# EAGLE schematic schematic (EAGLE 7.2.0)
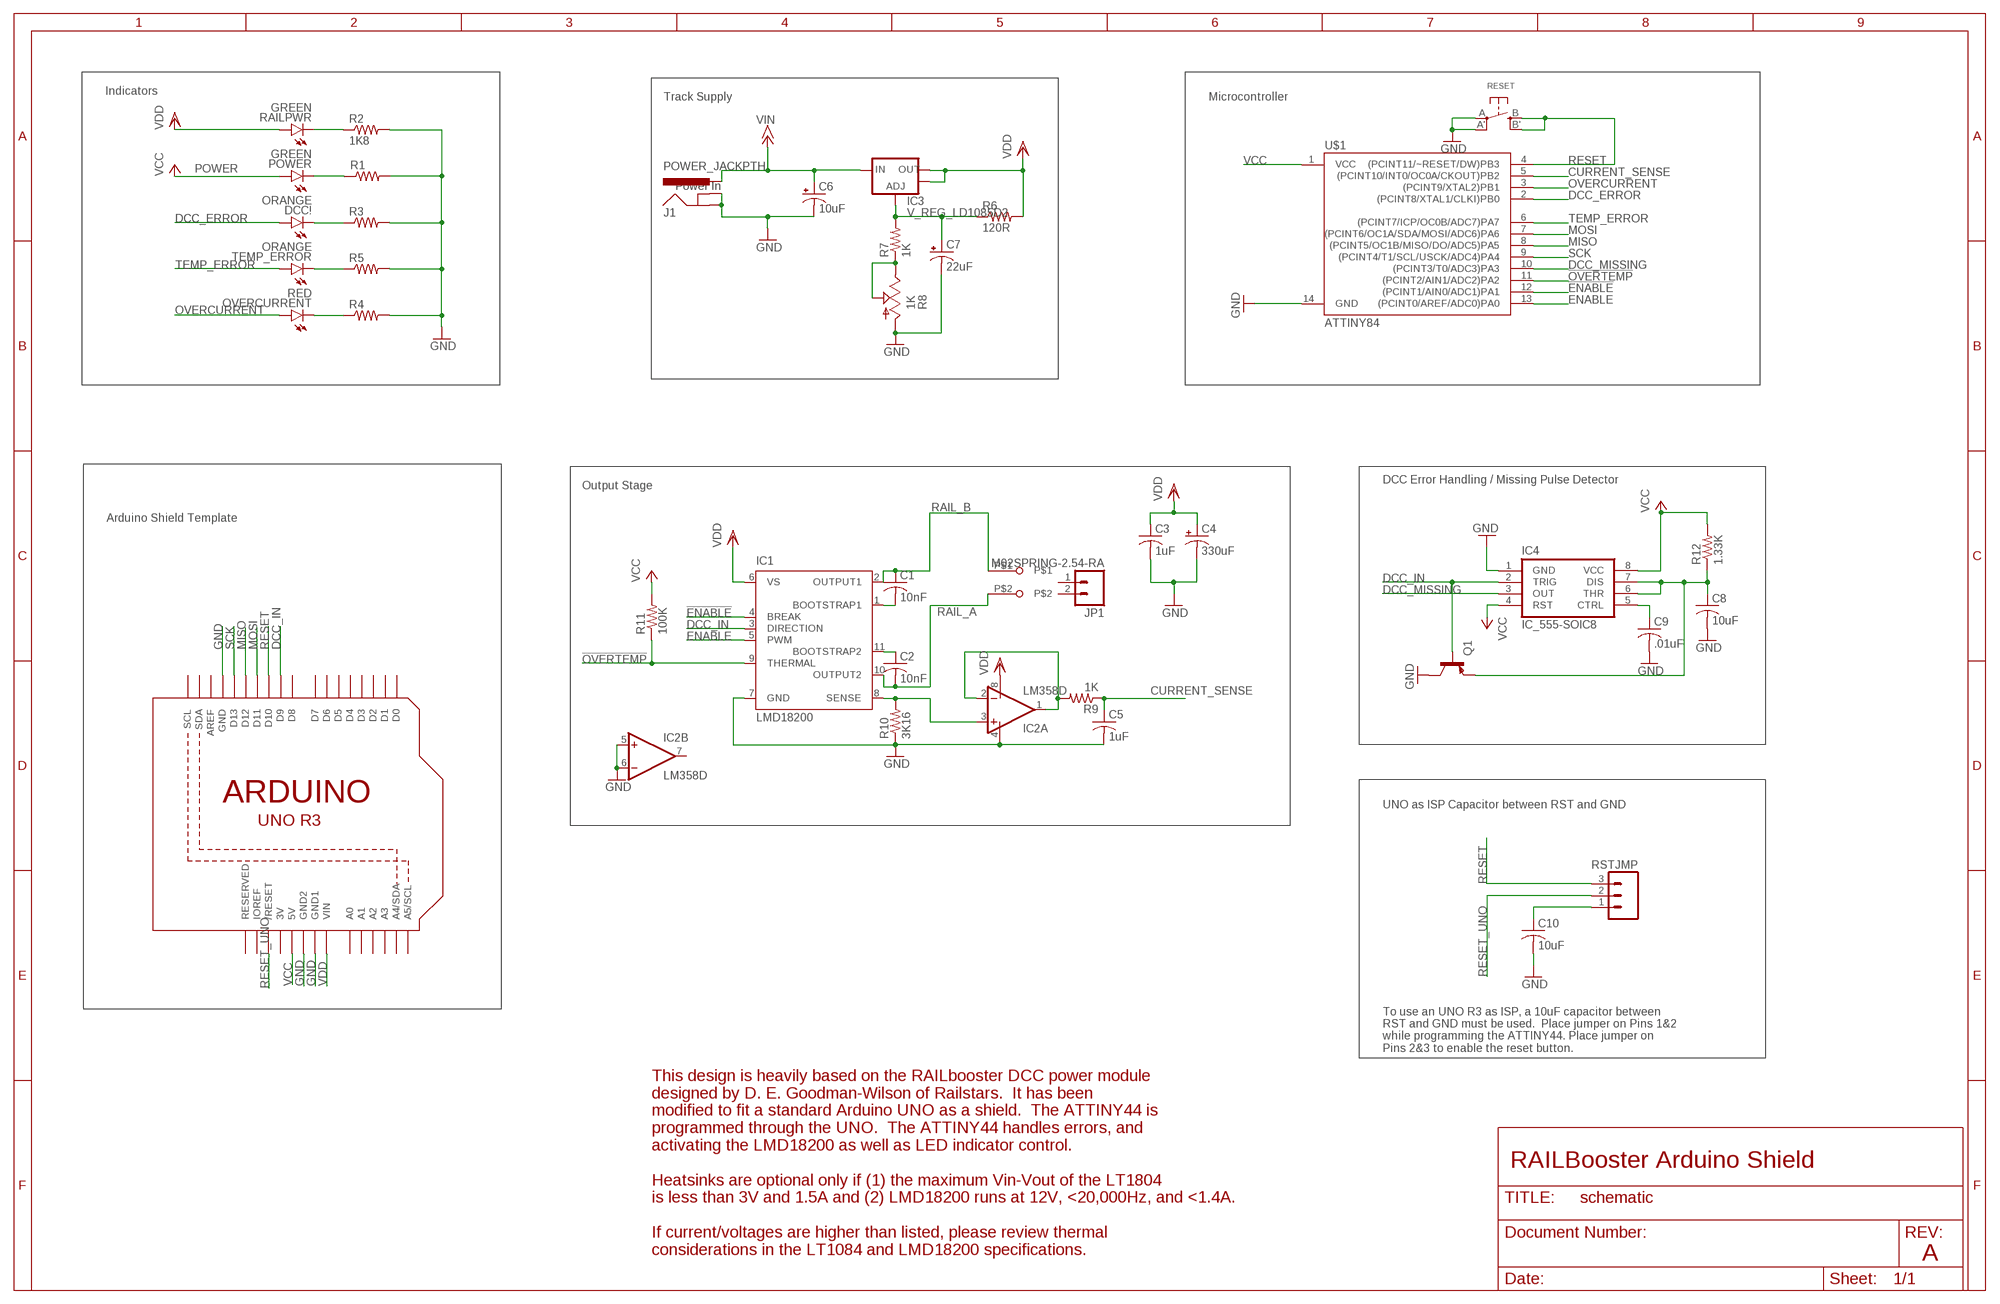
[diagram p0: schematic, sheet 1]

## Parts
C1  10nF  C-USC1206  [C1206]
C2  10nF  C-USC1206  [C1206]
C3  1uF  C-USC1206  [C1206]
C4  330uF  CPOL-USE5-10.5  [E5-10,5]
C5  1uF  C-USC1206  [C1206]
C6  10uF  CPOL-USE2-5  [E2-5]
C7  22uF  CPOL-USE2-5  [E2-5]
C8  10uF  C-USC1206  [C1206]
C9  .01uF  C-USC1206  [C1206]
C10  10uF  C-USC1206  [C1206]
DCC!  ORANGE  LED1206  [LED-1206]
IC1  LMD18200  LM18200T  [TO-220-11]
IC2  LM358D  [SO08]
IC3  V_REG_LD1085D2  [D2PACK/A]
IC4  IC_555-SOIC8  [SOIC-8]
J1  POWER_JACKPTH  [POWER_JACK_PTH]
JP1  M02SPRING-2.54-RA  [SPRINGTERMINAL-2.54MM-2]
OVERCURRENT  RED  LED1206  [LED-1206]
POWER  GREEN  LED1206  [LED-1206]
Q1  TRANSISTOR_BJT_PNP-SOT-23-BCE  [SOT-23]
R1  RESISTOR1206  [1206]
R2  1K8  RESISTOR1206  [1206]
R3  RESISTOR1206  [1206]
R4  RESISTOR1206  [1206]
R5  RESISTOR1206  [1206]
R6  120R  RESISTOR1206  [1206]
R7  1K  RESISTOR1206  [1206]
R8  1K  TRIM_US-S64W  [S64W]
R9  1K  RESISTOR1206  [1206]
R10  3K16  RESISTOR1206  [1206]
R11  100K  RESISTOR1206  [1206]
R12  1.33K  RESISTOR1206  [1206]
RAILPWR  GREEN  LED1206  [LED-1206]
RESET  SWITCH_TACT_SMT  [EVQ-Q2]
RSTJMP  M03PTH  [1X03]
TEMP_ERROR  ORANGE  LED1206  [LED-1206]
U1  ARDUINOR3-DIMENSION  [ARDUINOR3]
U$1  ATTINY84  [SO14]
X4  SCREWTERMINAL-5.08-2  [SCREWTERMINAL-5.08-2]

## Nets
!ENABLE: IC1.4(BREAK) U$1.12((PCINT1/AIN0/ADC1)PA1)
!OVERTEMP: IC1.9(THERMAL) R11.1 U$1.11((PCINT2/AIN1/ADC2)PA2)
CTRL: C9.1 IC4.5(CTRL)
CURRENT_SENSE: C5.1 R9.1 U$1.5((PCINT10/INT0/OC0A/CKOUT)PB2)
CURRENT_SENSE_UNBUFFERED: IC2.1(A:OUT) IC2.2(A:-IN) R9.2
DCC_ERROR: DCC!.A U$1.2((PCINT8/XTAL1/CLKI)PB0)
DCC_IN: IC1.3(DIRECTION) IC4.2(TRIG) Q1.1(B) U1.D9
DCC_MISSING: IC4.3(OUT) U$1.10((PCINT3/T0/ADC3)PA3)
ENABLE: IC1.5(PWM) U$1.13((PCINT0/AREF/ADC0)PA0)
GND: C3.2 C4.- C5.2 C6.- C7.- C8.2 C9.2 C10.2 IC1.7(GND) IC2.4(P:V-) IC2.5(B:+IN) IC2.6(B:-IN) IC4.1(GND) J1.GND J1.GNDBREAK Q1.2(C) R1.2 R2.2 R3.2 R4.2 R5.2 R8.A R10.1 RESET.A'(P1) RESET.A(P) U1.GND U1.GND1 U1.GND2 U$1.14(GND)
MISO: U1.D12 U$1.8((PCINT5/OC1B/MISO/DO/ADC5)PA5)
MOSI: U1.D11 U$1.7((PCINT6/OC1A/SDA/MOSI/ADC6)PA6)
N$1: R7.1 R8.E R8.S
N$2: C1.2 IC1.1(BOOTSTRAP1)
N$3: C2.1 IC1.11(BOOTSTRAP2)
N$4: IC1.8(SENSE) IC2.3(A:+IN) R10.2
N$5: POWER.C R1.1
N$6: C7.+ IC3.1(ADJ) R6.1 R7.2
N$7: C10.1 RSTJMP.1
N$8: DCC!.C R3.1
N$9: R5.1 TEMP_ERROR.C
N$13: R2.1 RAILPWR.C
N$14: C8.1 IC4.6(THR) IC4.7(DIS) Q1.3(E) R12.1
N$15: OVERCURRENT.C R4.1
OVERCURRENT: OVERCURRENT.A U$1.3((PCINT9/XTAL2)PB1)
RAIL_A: C2.2 IC1.10(OUTPUT2) X4.P$2
RAIL_B: C1.1 IC1.2(OUTPUT1) X4.P$1
RESET: RESET.B'(S1) RESET.B(S) RSTJMP.3 U1.D10 U$1.4((PCINT11/~RESET/DW)PB3)
RESET_UNO: RSTJMP.2 U1.RESET(/RESET)
SCK: U1.D13 U$1.9((PCINT4/T1/SCL/USCK/ADC4)PA4)
TEMP_ERROR: TEMP_ERROR.A U$1.6((PCINT7/ICP/OC0B/ADC7)PA7)
VCC: IC4.4(RST) IC4.8(VCC) POWER.A R11.2 R12.2 U1.5V U$1.1(VCC)
VDD: C3.1 C4.+ IC1.6(VS) IC2.8(P:V+) IC3.2(OUT) IC3.TAB(OUT) R6.2 RAILPWR.A U1.VIN
VIN: C6.+ IC3.3(IN) J1.PWR
Unconnected: IC2.7(B:OUT) JP1.1 JP1.2 U1.A0 U1.A1 U1.A2 U1.A3 U1.A4(A4/SDA) U1.A5(A5/SCL) U1.AREF U1.D0 U1.D1 U1.D2 U1.D3 U1.D4 U1.D5 U1.D6 U1.D7 U1.D8 U1.IOREF U1.RESERVED U1.SCL U1.SDA

## Notes on the sheet
- Indicators
- Track Supply | Microcontroller
- POWER
- Power In
- DCC Error Handling / Missing Pulse Detector
- Output Stage
- Arduino Shield Template
- UNO as ISP Capacitor between RST and GND
- To use an UNO R3 as ISP, a 10uF capacitor between
  RST and GND must be used.  Place jumper on Pins 1&2
  while programming the ATTINY44. Place jumper on
  Pins 2&3 to enable the reset button.
- RAILBooster Arduino Shield
- This design is heavily based on the RAILbooster DCC power module
  designed by D. E. Goodman-Wilson of Railstars.  It has been
  modified to fit a standard Arduino UNO as a shield.  The ATTINY44 is
  programmed through the UNO.  The ATTINY44 handles errors, and 
  activating the LMD18200 as well as LED indicator control.
  
  Heatsinks are optional only if (1) the maximum Vin-Vout of the LT1804
  is less than 3V and 1.5A and (2) LMD18200 runs at 12V, <20,000Hz, and <1.4A.
  
  If current/voltages are higher than listed, please review thermal
  considerations in the LT1084 and LMD18200 specifications.
- A

## Power pins joined to a net without a drawn wire
3V: U1.3V

## Library data of the parts
C1-C3 C5 C8-C10 = resistor:C-US: CAPACITOR, American symbol
C4 C6 C7 = rcl:CPOL-US: POLARIZED CAPACITOR, American symbol
DCC! OVERCURRENT POWER RAILPWR TEMP_ERROR = SparkFun-LED:LED: LEDs Standard schematic elements and footprints for 5mm, 3mm, 1206, and 0603 sized LEDs. 5mm - Spark Fun Electronics SKU : COM-00529 (and others)
IC1 = national-semiconductor:LM18200T: 3A, 55V H-Bridge Motor Control SourcE: http://cache.national.com/ds/LM/LMD18200.pdf; OC_FARNELL: unknown; OC_NEWARK: unknown
IC2 = linear:LM358: OP AMP also LM158; LM258; LM2904 Source: http://cache.national.com/ds/LM/LM158.pdf
IC3 = SparkFun-PowerIC:V_REG_LD1085: LD1085 3A low-drop positive voltage regulator, adjustable The LD1085xx is a low drop voltage regulator able to provide up to 3 A of output current. Dropout is guaranteed at a maximum of 1.2 V at the maximum output current, decreasing at lower loads. The LD1085xx is pin to pin compatible with the older 3-terminal adjustable regulators, but has better performances in term of drop and output tolerance. Available Packages D2PAK/A - 3-pin w/ tabs, SMD
IC4 = dp_devices:IC_555: Classic 555 IC
J1 = SparkFun:POWER_JACK: Power Jack This is the standard 5.5mm barrel jack for power. The PTH is the most common, proven, reliable, footprint. All others are experimental. The Slot footprint only works if the mill layer is transmitted to the PCB fab house so be warned. Spark Fun Electronics SKU : PRT-00119. Mating wall wart : TOL-00298 (and others)
JP1 = SparkFun-Connectors:M02: Standard 2-pin 0.1" header. Use with - straight break away headers ( PRT-00116) - right angle break away headers (PRT-00553) - swiss pins (PRT-00743) - machine pins (PRT-00117) - female headers (PRT-00115) Molex polarized connector foot print use with: PRT-08233 with associated crimp pins and housings. 2.54_SCREWTERM for use with PRT-10571. 3.5mm Screw Terminal footprints for PRT-08084 5mm Screw Terminal footprints for use with PRT-08432
Q1 = dp_devices:TRANSISTOR_BJT_PNP: Most commonly used is SOT23-BEC
R1-R7 R9-R12 = benjamin:RESISTOR: Resistor Basic schematic elements and footprints for 0603, 1206, and PTH resistors.
R8 = pot:TRIM_US-: POTENTIOMETER
RESET = microbuilder:SWITCH_TACT_SMT: SMT Tact Switches 6x6mm - Digikey: P12940SCT-ND KMR2 (4.6x2.8mm) - Digikey: 401-1426-1-ND EVQ-PQHB55 - Light Touch, 160GF (4.5x4.5mm) - Digikey: P8090SCT-ND KMT0 - KMT021 NGJ LHS (etc.) IP68/Waterproof - Digikey: CKN10289CT-ND
RSTJMP = SparkFun-Connectors:M03: Header 3 Standard 3-pin 0.1" header. Use with straight break away headers (SKU : PRT-00116), right angle break away headers (PRT-00553), swiss pins (PRT-00743), machine pins (PRT-00117), and female headers (PRT-00115). Molex polarized connector foot print use with SKU : PRT-08232 with associated crimp pins and housings.
U1 = adafruit:ARDUINOR3: This is a new object for the new Arduino R3 - with extra pins that you may want to use (such as IOref, and duplicated A4/A5
U$1 = SparkFun-DigitalIC:ATTINY84: Atmel 14-pin 2/4/8kB flash uC; PROD_ID: IC-11285
X4 = Artificial Science:SCREWTERMINAL-5.08-2

## Net classes
2 gnd: width 0.305 mm, drill 0.483 mm, clearance 0.203 mm